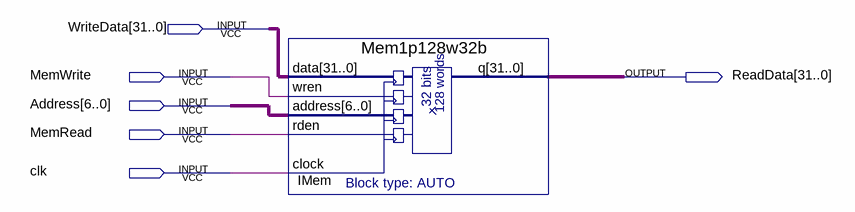
[diagram p0: schematic sheet]
// Quartus schematic IMem.bdf as structural Verilog: 1 symbols, 6 pins
module IMem (
  input  [31:0] WriteData,
  input  MemWrite,
  input  [6:0] Address,
  input  MemRead,
  input  clk,
  output [31:0] ReadData
);

  Mem1p128w32b IMem (.data(WriteData), .wren(MemWrite), .address(Address), .rden(MemRead), .clock(clk), .q(ReadData));
endmodule
